# EAGLE schematic attiniest85-power-shield-mk-1.0 (EAGLE 6.5.0)
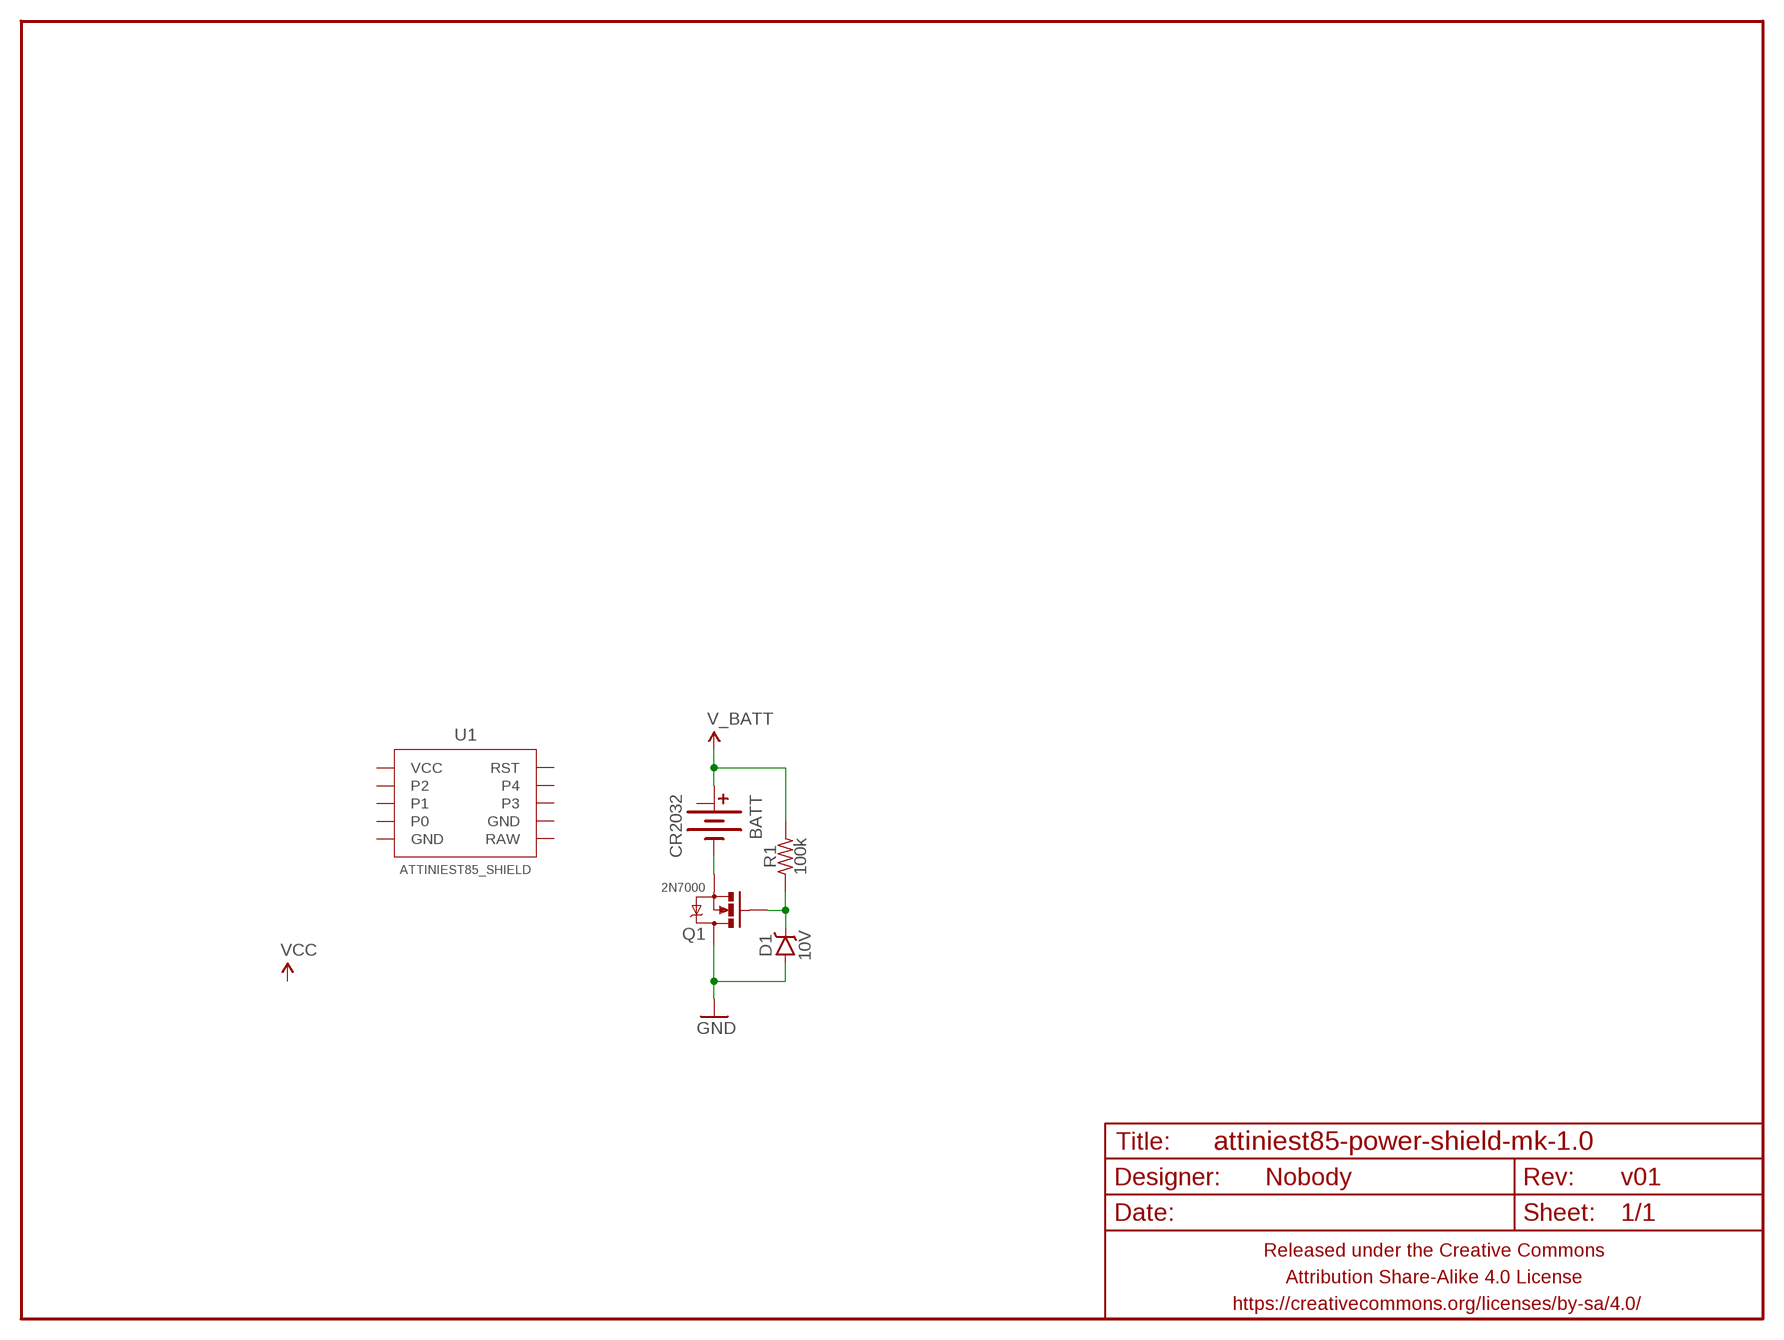
[diagram p0: schematic, sheet 1]

## Parts
BATT  CR2032  BATTERY-COINCR2032_SMD  [BATTCON_20MM_MINE]
D1  10V  DIODE-ZENER7.62MM-PTH  [DIODE-ZENNER-7.62MM]
FRAME1  FRAME-LETTERNO_PACKAGE  [DUMMY]
Q1  2N7000  MOSFET-NCHANNEL2N7000-AMMO  [TO-92-AMMO]
R1  100k  RESISTORPTH-AXIAL-7.62MM  [RESISTOR-AXIAL-PTH-7.62MM]
U1  ATTINIEST85_SHIELD  [ATTINIEST85_SHIELD]

## Nets
GND: D1.A Q1.3(D)
N$1: BATT.BOTTOM(-) Q1.1(S)
N$2: D1.K(C) Q1.2(G) R1.P$1
V_BATT: BATT.TOP@1(+) R1.P$2
Unconnected: BATT.TOP@2(+1) U1.0 U1.1 U1.2 U1.3 U1.4 U1.GND@1(GND) U1.GND@2(GND) U1.RAW U1.RST U1.VCC

## Library data of the parts
BATT = A_butts:BATTERY-COIN
D1 = A_butts:DIODE-ZENER: Zener Diode Production Part - 8199 3.4V Zener Voltage
FRAME1 = A_butts:FRAME-LETTER: Schematic Frame Standard 8.5x11 US Letter frame; DESIGNER: Nobody; VERSION: v01
Q1 = A_butts:MOSFET-NCHANNEL: Common NMOSFET Parts MFG P/N Store ID Prod ID FDD8780 TRANS-09984 SI7820DN TRANS-11055 FDS6630A IC-08089 2N7002PW TRANS-11151 FQP30N06L COM-10213 TRANS-10060 BSS123LT1G TRANS-08345 BSS138 TRANS-00830 BS170 2N7000
R1 = A_butts:RESISTOR: RESISTOR, American symbol
U1 = A_butts:ATTINIEST85_SHIELD